# Altium schematic sheet SCT2XX0 STEP-DOWM.SchDoc
size A4; Organization: Altium Limited; Address1: L3, 12a Rodborough Rd; Address2: Frenchs Forest; Address3: NSW; Address4: Australia 2086
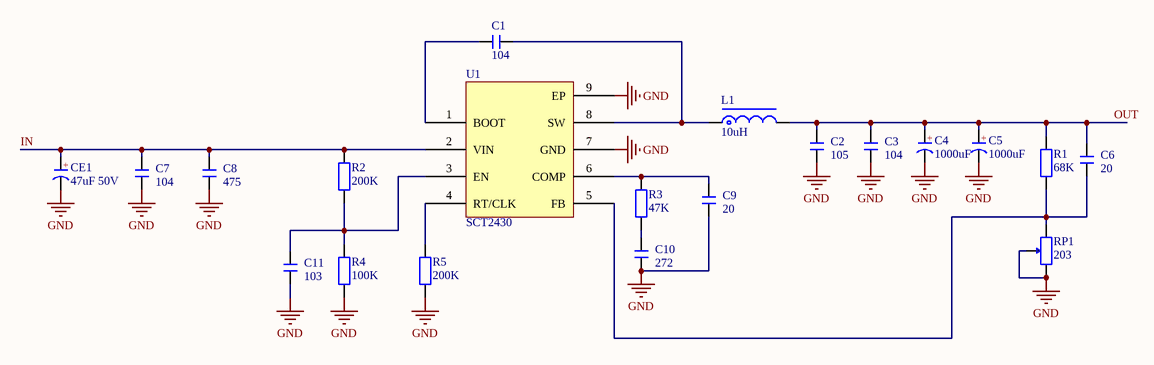
[diagram p0: SCT2XX0 STEP-DOWM.SchDoc]

## Parts
C1  104  [C 0805_L]
C2  105  [C 0805_L]
C3  104  [C 0805_L]
C4  1000uF  [CAP 7.5*16*25]
C5  1000uF  [CAP 5.0*12.5*20]
C6  20  [C 0805_L]
C7  104  [C 0805_L]
C8  475  [C 0805_L]
C9  20  [C 0805_L]
C10  272  [C 0805_L]
C11  103  [C 0805_L]
CE1  47uF 50V  [CM C(5*5.4)]
L1  10uH  [CDRH127]
R1  68K  [R 0805_L]
R2  200K  [R 0805_L]
R3  47K  [R 0805_L]
R4  100K  [R 0805_L]
R5  200K  [R 0805_L]
RP1  203  [3296W]
U1  SCT2430  [ESOP8_N]

## Nets
GND: C2.1 C3.1 C4.2(K) C5.2(K) C7.1 C8.1 C9.1 C10.1 C11.1 CE1.2(K) R4.1 R5.1 RP1.1 RP1.2 U1.7(GND) U1.9(EP)
IN: C7.2 C8.2 CE1.1(A) R2.2 U1.2(VIN)
OUT: C2.2 C3.2 C4.1(A) C5.1(A) C6.2 L1.2 R1.2
NetC1_1: C1.1 U1.1(BOOT)
NetC1_2: C1.2 L1.1 U1.8(SW)
NetC6_1: C6.1 R1.1 RP1.3 U1.5(FB)
NetC9_2: C9.2 R3.2 U1.6(COMP)
NetC10_2: C10.2 R3.1
NetC11_2: C11.2 R2.1 R4.2 U1.3(EN)
NetR5_2: R5.2 U1.4(RT/CLK)

## Notes on the sheet
- Title
- Size:
- Date:
- A4
- Number:
- Time:
- Revision:
- Sheet
- of
- File:
- (in symbol CE) +
- (in symbol CE_SMD) +

## Library data of the parts
C1-C3 C6-C11 = C: 贴片电容; 淘宝ID: 小糖豆的小窝窝; BOM名称: 贴片电容; 下单链接: https://item.taobao.com/item.htm?ft=t&id=613637044352
C4 C5 = CE: 直插电解电容; 淘宝ID: 小糖豆的小窝窝; BOM名称: 直插电解电容; 下单链接: https://item.taobao.com/item.htm?ft=t&id=613637044352
CE1 = CE_SMD: 贴片电解电容; 淘宝ID: 小糖豆的小窝窝; BOM名称: 贴片电解电容; 下单链接: https://item.taobao.com/item.htm?ft=t&id=613637044352
L1 = L-CDRH: 功率屏蔽电感; 淘宝ID: 小糖豆的小窝窝; BOM名称: 功率屏蔽电感; 下单链接: https://item.taobao.com/item.htm?ft=t&id=613637044352
R1-R5 = R: 贴片电阻; 淘宝ID: 小糖豆的小窝窝; BOM名称: 贴片电阻; 下单链接: https://item.taobao.com/item.htm?ft=t&id=613637044352
RP1 = RP: 单联电位器; 淘宝ID: 小糖豆的小窝窝; BOM名称: 单联电位器; 下单链接: https://item.taobao.com/item.htm?ft=t&id=613637044352